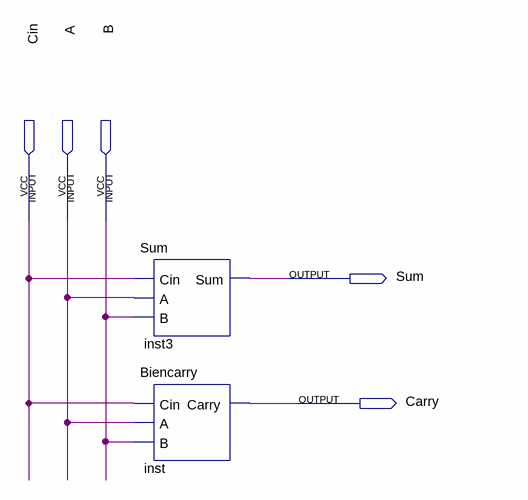
[diagram p0: schematic sheet]
// Quartus schematic Fulladder1bit.bdf as structural Verilog: 2 symbols, 5 pins
module Fulladder1bit (
  input  Cin,
  input  A,
  input  B,
  output Sum,
  output Carry
);

  Sum inst3 (.Cin(Cin), .A(A), .B(B), .Sum(Sum));
  Biencarry inst (.Cin(Cin), .A(A), .B(B), .Carry(Carry));
endmodule
